# Altium schematic sheet ADV7123.SchDoc
size A4
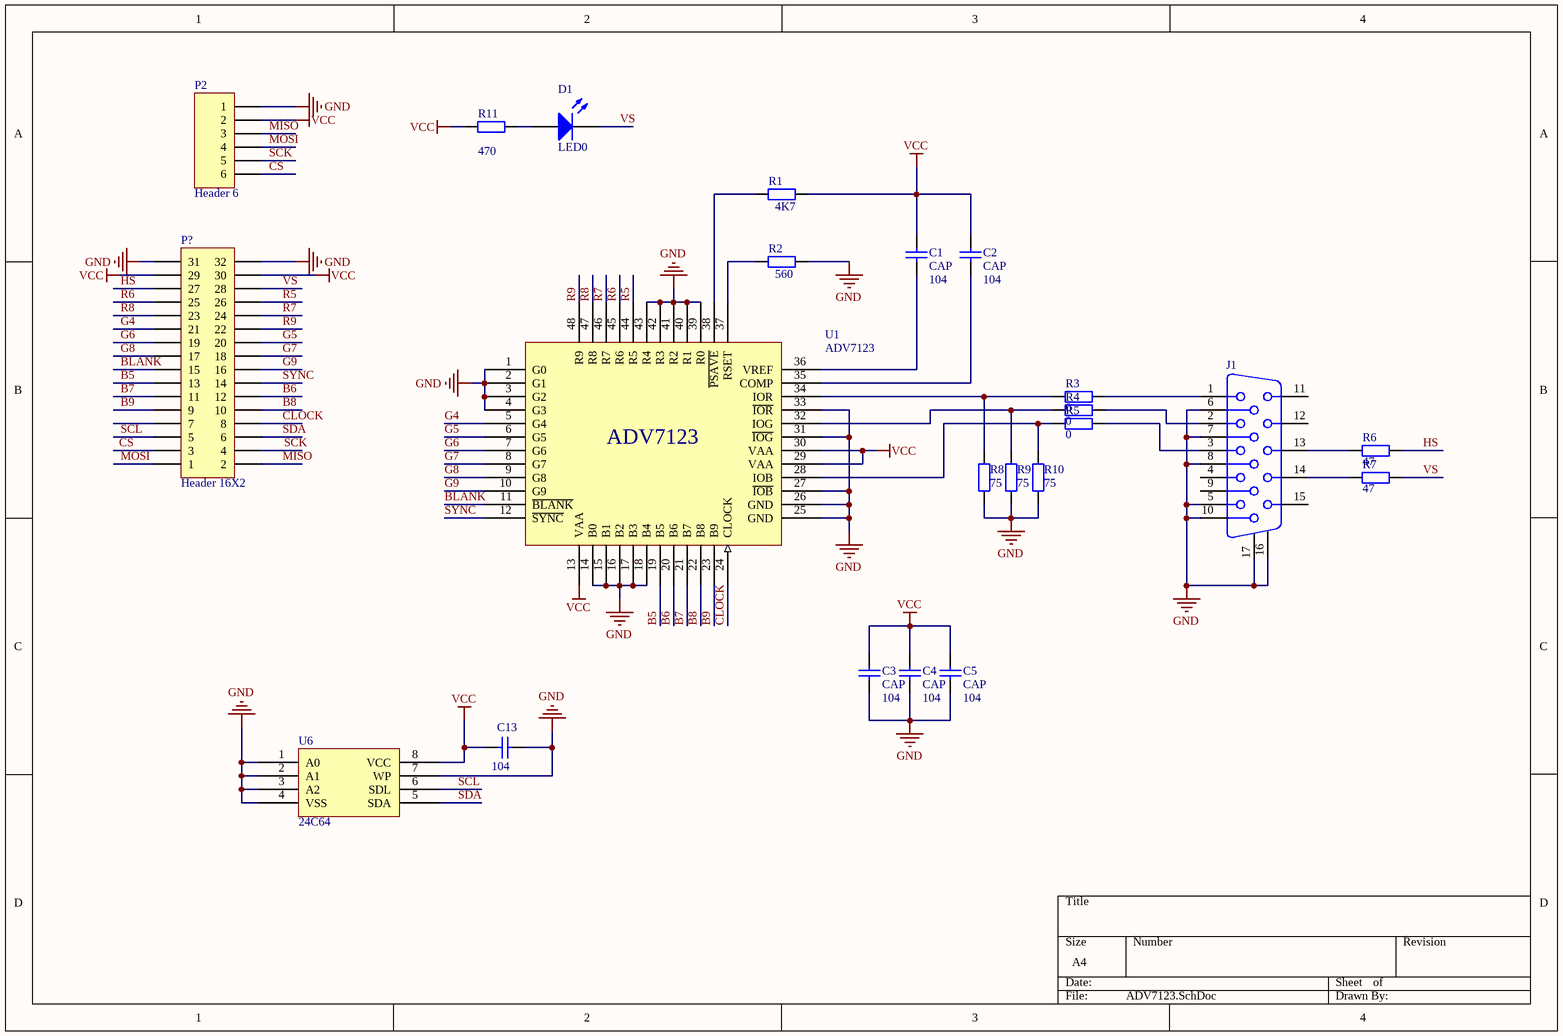
[diagram p0: ADV7123.SchDoc]

## Parts
C1  CAP  value 104  [C-0805]
C2  CAP  value 104  [C-0805]
C3  CAP  value 104  [C-0805]
C4  CAP  value 104  [C-0805]
C5  CAP  value 104  [C-0805]
C13  value 104  [C-0805]  (hidden comment: Cap)
D1  LED0  [0603-1]
J1  D Connector 15  [DB15-F]  (value not drawn)
P2  Header 6  [HDR1X6]
P?  Header 16X2  [HDR2X16]
R1  value 4K7  [0805]  (hidden comment: Res2)
R2  value 560  [0805]  (hidden comment: Res2)
R3  value 0  [0805]  (hidden comment: Res2)
R4  value 0  [0805]  (hidden comment: Res2)
R5  value 0  [0805]  (hidden comment: Res2)
R6  value 47  [0805]  (hidden comment: Res2)
R7  value 47  [0805]  (hidden comment: Res2)
R8  value 75  [0805]  (hidden comment: Res2)
R9  value 75  [0805]  (hidden comment: Res2)
R10  value 75  [0805]  (hidden comment: Res2)
R11  value 470  [0805]  (hidden comment: Res2)
U1  ADV7123  [QFP48]
U6  24C64  [SO-8]

## Nets
GND: C3.1 C4.1 C5.1 C13.2 J1.5 J1.6 J1.7 J1.8 J1.10 J1.16(MH2) J1.17(MH1) P2.1 P?.31 P?.32 R2.2 R8.1 R9.1 R10.1 U1.1(G0) U1.2(G1) U1.3(G2) U1.4(G3) U1.14(B0) U1.15(B1) U1.16(B2) U1.17(B3) U1.18(B4) U1.25(GND) U1.26(GND) U1.27(~{IOB}) U1.31(~{IOG}) U1.33(~{IOR}) U1.39(R0) U1.40(R1) U1.41(R2) U1.42(R3) U1.43(R4) U6.1(A0) U6.2(A1) U6.3(A2) U6.4(VSS) U6.7(WP)
VCC: C1.2 C2.2 C3.2 C4.2 C5.2 C13.1 P2.2 P?.29 P?.30 R1.2 R11.1 U1.13(VAA) U1.29(VAA) U1.30(VAA) U6.8(VCC)
B5: P?.13 U1.19(B5)
B6: P?.12 U1.20(B6)
B7: P?.11 U1.21(B7)
B8: P?.10 U1.22(B8)
B9: P?.9 U1.23(B9)
BLANK: P?.15 U1.11(~{BLANK})
CLOCK: P?.8 U1.24(CLOCK)
CS: P2.6 P?.3
G4: P?.21 U1.5(G4)
G5: P?.20 U1.6(G5)
G6: P?.19 U1.7(G6)
G7: P?.18 U1.8(G7)
G8: P?.17 U1.9(G8)
G9: P?.16 U1.10(G9)
HS: P?.27 R6.1
MISO: P2.3 P?.2
MOSI: P2.4 P?.1
R5: P?.26 U1.44(R5)
R6: P?.25 U1.45(R6)
R7: P?.24 U1.46(R7)
R8: P?.23 U1.47(R8)
R9: P?.22 U1.48(R9)
SCK: P2.5 P?.4
SCL: P?.5 U6.6(SDL)
SDA: P?.6 U6.5(SDA)
SYNC: P?.14 U1.12(~{SYNC})
VS: D1.2(K) P?.28 R7.1
NetC1_1: C1.1 U1.36(VREF)
NetC2_1: C2.1 U1.35(COMP)
NetD1_1: D1.1(A) R11.2
NetJ1_1: J1.1 R3.1
NetJ1_2: J1.2 R4.1
NetJ1_3: J1.3 R5.1
NetJ1_13: J1.13 R6.2
NetJ1_14: J1.14 R7.2
NetR1_1: R1.1 U1.38(~{PSAVE})
NetR2_1: R2.1 U1.37(RSET)
NetR3_2: R3.2 R8.2 U1.34(IOR)
NetR4_2: R4.2 R9.2 U1.32(IOG)
NetR5_2: R5.2 R10.2 U1.28(IOB)

Not connected (* = marked no-connect by the designer): J1 4 9 11 12 15; P? 7

## Library data of the parts
C13 = Cap: Capacitor; Published: 8-Jun-2000; LatestRevisionDate: 17-Jul-2002; LatestRevisionNote: Re-released for DXP Platform.; PackageReference: RAD-0.3; Publisher: Altium Limited; PackageDescription: Radial Cap, Thru-Hole; 2 Leads; 0.3 in Pin Spacing
D1 = LED0: Typical INFRARED GaAs LED; Published: 8-Jun-2000; LatestRevisionDate: 08-Jul-2005; LatestRevisionNote: Mech Layer 1 removed.; PackageReference: LED-0; Publisher: Altium Limited; PackageDescription: LED; 2 Leads
J1 = D Connector 15: VGA; PackageDocument: O; Positions: 9; Gender: Receptacle; Published: 15-Jun-2001; LatestRevisionDate: 17-Jul-2002; LatestRevisionNote: Re-released for DXP Platform.; DatasheetDocument: 1-Sep-1999; PackageReference: 788750; Publisher: Altium Limited; Orientation: Right Angle
P2 = Header 6: Header, 6-Pin; LatestRevisionDate: 17-Jul-2002; LatestRevisionNote: Re-released for DXP Platform.; Publisher: Altium Limited
P? = Header 16X2: Header, 16-Pin, Dual row; LatestRevisionDate: 17-Jul-2002; LatestRevisionNote: Re-released for DXP Platform.; Publisher: Altium Limited
R1-R11 = Res2: Resistor; Published: 8-Jun-2000; LatestRevisionDate: 17-Jul-2002; LatestRevisionNote: Re-released for DXP Platform.; PackageReference: AXIAL-0.4; Publisher: Altium Limited; PackageDescription: Axial Device, Thru-Hole; 2 Leads; 0.4 in Pin Spacing
U6 = EEPROM_24C64